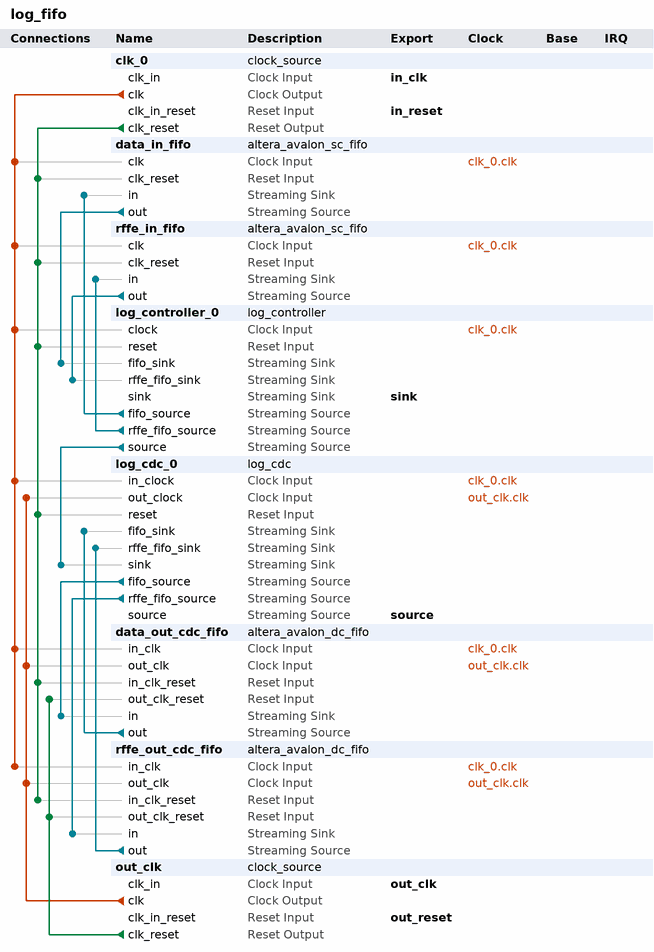
[diagram p0: system contents]
# Platform Designer (Qsys) system log_fifo, Cyclone V 5CSXFC6D6F31C6
# Parameters at their usual value, and those the tool derives, are not listed.
package require -exact qsys 20.1
create_system log_fifo
set_project_property DEVICE_FAMILY {Cyclone V}
set_project_property DEVICE 5CSXFC6D6F31C6

add_instance clk_0 clock_source 20.1
set_instance_parameter_value clk_0 clockFrequency 150000000

add_instance data_in_fifo altera_avalon_sc_fifo 20.1
set_instance_parameter_value data_in_fifo BITS_PER_SYMBOL 58
set_instance_parameter_value data_in_fifo CHANNEL_WIDTH 0
set_instance_parameter_value data_in_fifo ERROR_WIDTH 0
set_instance_parameter_value data_in_fifo FIFO_DEPTH 16384
set_instance_parameter_value data_in_fifo USE_FILL_LEVEL 0
set_instance_parameter_value data_in_fifo USE_MEMORY_BLOCKS 1
set_instance_parameter_value data_in_fifo USE_STORE_FORWARD 0

add_instance rffe_in_fifo altera_avalon_sc_fifo 20.1
set_instance_parameter_value rffe_in_fifo BITS_PER_SYMBOL 13
set_instance_parameter_value rffe_in_fifo CHANNEL_WIDTH 0
set_instance_parameter_value rffe_in_fifo ERROR_WIDTH 0
set_instance_parameter_value rffe_in_fifo FIFO_DEPTH 16
set_instance_parameter_value rffe_in_fifo USE_FILL_LEVEL 0
set_instance_parameter_value rffe_in_fifo USE_MEMORY_BLOCKS 1
set_instance_parameter_value rffe_in_fifo USE_STORE_FORWARD 0

add_instance log_controller_0 log_controller 0.1
set_instance_parameter_value log_controller_0 AMPS_WIDTH 3
set_instance_parameter_value log_controller_0 ATTENUATOR_WIDTH 6
set_instance_parameter_value log_controller_0 DATA_OUT_WIDTH 32
set_instance_parameter_value log_controller_0 DATA_WIDTH 58
set_instance_parameter_value log_controller_0 FILTERS_WIDTH 2
set_instance_parameter_value log_controller_0 MAX_PACKET_LEN 16384
set_instance_parameter_value log_controller_0 design_env QSYS

add_instance log_cdc_0 log_cdc 0.1
set_instance_parameter_value log_cdc_0 AMPS_WIDTH 3
set_instance_parameter_value log_cdc_0 ATTENUATOR_WIDTH 6
set_instance_parameter_value log_cdc_0 DATA_WIDTH 32
set_instance_parameter_value log_cdc_0 FILTERS_WIDTH 2
set_instance_parameter_value log_cdc_0 MAX_PACKET_LEN 16384
set_instance_parameter_value log_cdc_0 design_env QSYS

add_instance data_out_cdc_fifo altera_avalon_dc_fifo 20.1
set_instance_parameter_value data_out_cdc_fifo BITS_PER_SYMBOL 32
set_instance_parameter_value data_out_cdc_fifo FIFO_DEPTH 16
set_instance_parameter_value data_out_cdc_fifo USE_PACKETS 0

add_instance rffe_out_cdc_fifo altera_avalon_dc_fifo 20.1
set_instance_parameter_value rffe_out_cdc_fifo BITS_PER_SYMBOL 13
set_instance_parameter_value rffe_out_cdc_fifo FIFO_DEPTH 16
set_instance_parameter_value rffe_out_cdc_fifo USE_PACKETS 0

add_instance out_clk clock_source 20.1
set_instance_parameter_value out_clk clockFrequency 50000000

# connections
add_connection clk_0.clk data_in_fifo.clk clock
add_connection clk_0.clk data_out_cdc_fifo.in_clk clock
add_connection clk_0.clk log_cdc_0.in_clock clock
add_connection clk_0.clk log_controller_0.clock clock
add_connection clk_0.clk rffe_in_fifo.clk clock
add_connection clk_0.clk rffe_out_cdc_fifo.in_clk clock
add_connection out_clk.clk data_out_cdc_fifo.out_clk clock
add_connection out_clk.clk log_cdc_0.out_clock clock
add_connection out_clk.clk rffe_out_cdc_fifo.out_clk clock
add_connection clk_0.clk_reset data_in_fifo.clk_reset reset
add_connection clk_0.clk_reset data_out_cdc_fifo.in_clk_reset reset
add_connection clk_0.clk_reset log_cdc_0.reset reset
add_connection clk_0.clk_reset log_controller_0.reset reset
add_connection clk_0.clk_reset rffe_in_fifo.clk_reset reset
add_connection clk_0.clk_reset rffe_out_cdc_fifo.in_clk_reset reset
add_connection out_clk.clk_reset data_out_cdc_fifo.out_clk_reset reset
add_connection out_clk.clk_reset rffe_out_cdc_fifo.out_clk_reset reset
add_connection data_in_fifo.out log_controller_0.fifo_sink avalon_streaming
add_connection data_out_cdc_fifo.out log_cdc_0.fifo_sink avalon_streaming
add_connection log_cdc_0.fifo_source data_out_cdc_fifo.in avalon_streaming
add_connection log_cdc_0.rffe_fifo_source rffe_out_cdc_fifo.in avalon_streaming
add_connection log_controller_0.fifo_source data_in_fifo.in avalon_streaming
add_connection log_controller_0.rffe_fifo_source rffe_in_fifo.in avalon_streaming
add_connection log_controller_0.source log_cdc_0.sink avalon_streaming
add_connection rffe_in_fifo.out log_controller_0.rffe_fifo_sink avalon_streaming
add_connection rffe_out_cdc_fifo.out log_cdc_0.rffe_fifo_sink avalon_streaming

# exported interfaces
add_interface in_clk clock sink
set_interface_property in_clk EXPORT_OF clk_0.clk_in
add_interface in_reset reset sink
set_interface_property in_reset EXPORT_OF clk_0.clk_in_reset
add_interface out_clk clock sink
set_interface_property out_clk EXPORT_OF out_clk.clk_in
add_interface out_reset reset sink
set_interface_property out_reset EXPORT_OF out_clk.clk_in_reset
add_interface sink avalon_streaming sink
set_interface_property sink EXPORT_OF log_controller_0.sink
add_interface source avalon_streaming source
set_interface_property source EXPORT_OF log_cdc_0.source

set_interconnect_requirement {$system} qsys_mm.clockCrossingAdapter HANDSHAKE
set_interconnect_requirement {$system} qsys_mm.enableEccProtection FALSE
set_interconnect_requirement {$system} qsys_mm.insertDefaultSlave FALSE
set_interconnect_requirement {$system} qsys_mm.maxAdditionalLatency 1

save_system log_fifo.qsys
